# EAGLE design ESP_Breakout (EAGLE 9.2.0)
COMPANY: ADAFRUIT INDUSTRIES; DRAWN: KTOWN; REV: B
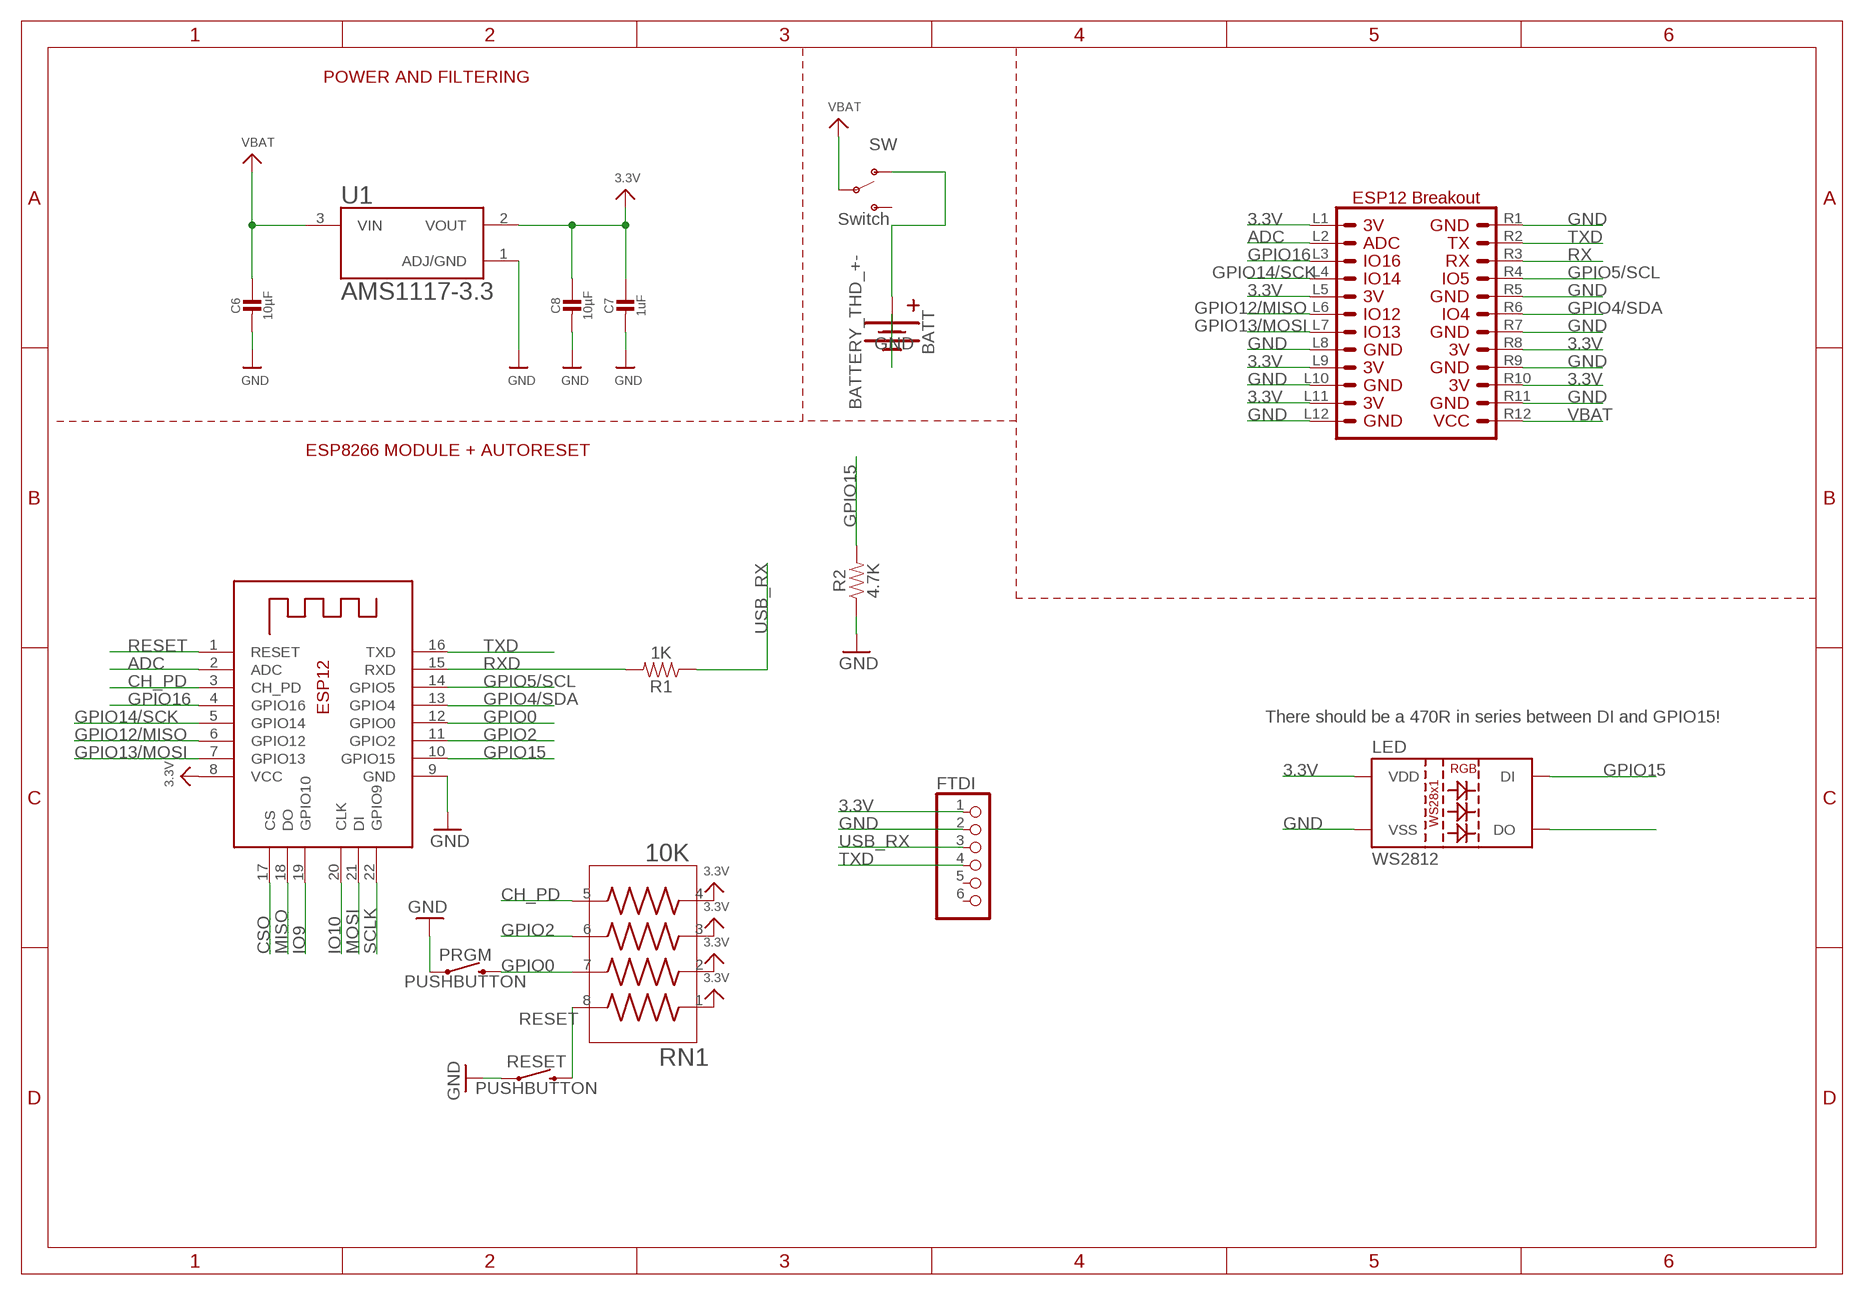
[diagram p0: schematic, sheet 1]

## Parts
BATT  BATTERY_THD_+-  [1X02_PLUS_MINUS]
C6  10µF  MICROBUILDER_CAP_CERAMIC_0805  [MICROBUILDER__0805]
C7  1uF  MICROBUILDER_CAP_CERAMIC_0603  [MICROBUILDER__0603]
C8  10µF  MICROBUILDER_CAP_CERAMIC_0805  [MICROBUILDER__0805]
FTDI  PINHD-1X6  [1X06]
LED  WS2812  [LED-TRICOLOR-5050-IC]
PRGM  PUSHBUTTON  [TACTILE_SWITCH_SMD_6.0X3.5MM]
R1  1K  RESISTOR1206  [1206]
R2  4.7K  RESISTOR1206  [1206]
RESET  PUSHBUTTON  [TACTILE_SWITCH_SMD_6.0X3.5MM]
RN1  10K  RESISTOR_ARRAY_1206  [RESCAF80P320X160X60-8N]
SW  Switch  SWITCH_SPDT_SLIDE  [SWITCH_SPDT_PTH_11.6X4.0MM]
U1  AMS1117-3.3  [SOT229P700X180-4N]
U$7  ESP12_BREAKOUT  [ESP12_BREAKOUT_CONN]
X2  ESP-12  ESP-12E  [ESP-12E]

## Nets
3.3V: C7.1 C8.1 FTDI.1 LED.VDD RN1.1 RN1.2 RN1.3 RN1.4 U1.2(VOUT) U$7.L1 U$7.L5 U$7.L9 U$7.L11 U$7.R8 U$7.R10 X2.8(VCC)
ADC: U$7.L2 X2.2(ADC)
CH_PD: RN1.5 X2.3(CH_PD)
CSO: X2.17(CS)
GND: BATT.- C6.2 C7.2 C8.2 FTDI.2 LED.VSS PRGM.1 R2.1 RESET.1 U1.1(ADJ/GND) U$7.L8 U$7.L10 U$7.L12 U$7.R1 U$7.R5 U$7.R7 U$7.R9 U$7.R11 X2.9(GND)
GPIO0: PRGM.2 RN1.7 X2.12(GPIO0)
GPIO2: RN1.6 X2.11(GPIO2)
GPIO4/SDA: U$7.R6 X2.13(GPIO4)
GPIO5/SCL: U$7.R4 X2.14(GPIO5)
GPIO12/MISO: U$7.L6 X2.6(GPIO12)
GPIO13/MOSI: U$7.L7 X2.7(GPIO13)
GPIO14/SCK: U$7.L4 X2.5(GPIO14)
GPIO15: LED.DIN(DI) R2.2 X2.10(GPIO15)
GPIO16: U$7.L3 X2.4(GPIO16)
IO9: X2.19(GPIO10)
IO10: X2.20(CLK)
MISO: X2.18(DO)
MOSI: X2.21(DI)
N$1: BATT.+ SW.1(O)
N$5: LED.DOUT(DO)
RESET: RESET.2 RN1.8 X2.1(RESET)
RX: U$7.R3
RXD: R1.2 X2.15(RXD)
SCLK: X2.22(GPIO9)
TXD: FTDI.4 U$7.R2 X2.16(TXD)
USB_RX: FTDI.3 R1.1
VBAT: C6.1 SW.2(P) U1.3(VIN) U$7.R12
Unconnected: FTDI.5 FTDI.6 SW.3(S)

## Notes on the sheet
- POWER AND FILTERING
- ESP8266 MODULE + AUTORESET
- There should be a 470R in series between DI and GPIO15!

## Library data of the parts
BATT = AutoPark:BATTERY_THD_+-
C6-C8 = AutoPark:MICROBUILDER_CAP_CERAMIC: Ceramic Capacitors For new designs, use the packages preceded by an '_' character since they are more reliable: The following footprints should be used on most boards: _0402 - Standard footprint for regular board layouts _0603 - Standard footprint for regular board layouts _0805 - Standard footprint for regular board layouts _1206 - Standard footprint for regular board layouts For extremely tight-pitch boards where space is at a premium, the following 'micro-pitch' footprints can be used (smaller pads, no silkscreen outline, etc.): _0402MP - Micro-pitch footprint for very dense/compact boards _0603MP - Micro-pitch footprint for very dense/compact boards _0805MP - Micro-pitch footprint for very dense/compact boards _1206MP - Micro-pitch footprint for very dense/compact boards
FTDI = pinhead:PINHD-1X6: PIN HEADER
LED = AutoPark:WS2812
PRGM RESET = AutoPark:PUSHBUTTON
R1 R2 = SparkFun-Resistors:RESISTOR: Generic Resistor Package
RN1 = AutoPark:RESISTOR_ARRAY_1206: Res Thick Film Array 75 Ohm 5% 0.25W(1/4W) ?200ppm/C ISOL Molded 8-Pin 1206(4 X 0603) Convex SMD T/R; AVAILABILITY: Unavailable; DESCRIPTION: Res Thick Film Array 75 Ohm 5% 0.25W_1/4W_ ?200ppm/C ISOL Molded 8-Pin 1206_4 X 0603_ Convex SMD T/R; MF: Bourns; MP: CAY16-750J4LF; PACKAGE: 1206 Bourns; PRICE: None
SW = AutoPark:SWITCH_SPDT_SLIDE: 拨动开关SK12D07VG2/3/4/5/6 侧面5脚拨动带支架 3脚2档柄高6MM Taobao <https://item.taobao.com/item.htm?spm=a1z09.2.0.0.53a62e8d0RVocC&id=563254128682&_u=s1po4ce26496> Dimensional Drawing <https://img.alicdn.com/imgextra/i1/2744920356/TB2568GkMDD8KJjy0FdXXcjvXXa_!!2744920356.jpg>
U1 = AutoPark:AMS1117-3.3: Sot223/Pkg 1-Amp 3.3-Volt Low Drop Out Voltage Regulatator; AVAILABILITY: Unavailable; DESCRIPTION: Sot223/Pkg 1-Amp 3.3-Volt Low Drop Out Voltage Regulatator; MF: Advanced Monolithic Systems; MP: AMS1117-3.3; PACKAGE: None; PRICE: None
U$7 = AutoPark:ESP12_BREAKOUT
X2 = microbuilder:ESP-12E

## Board
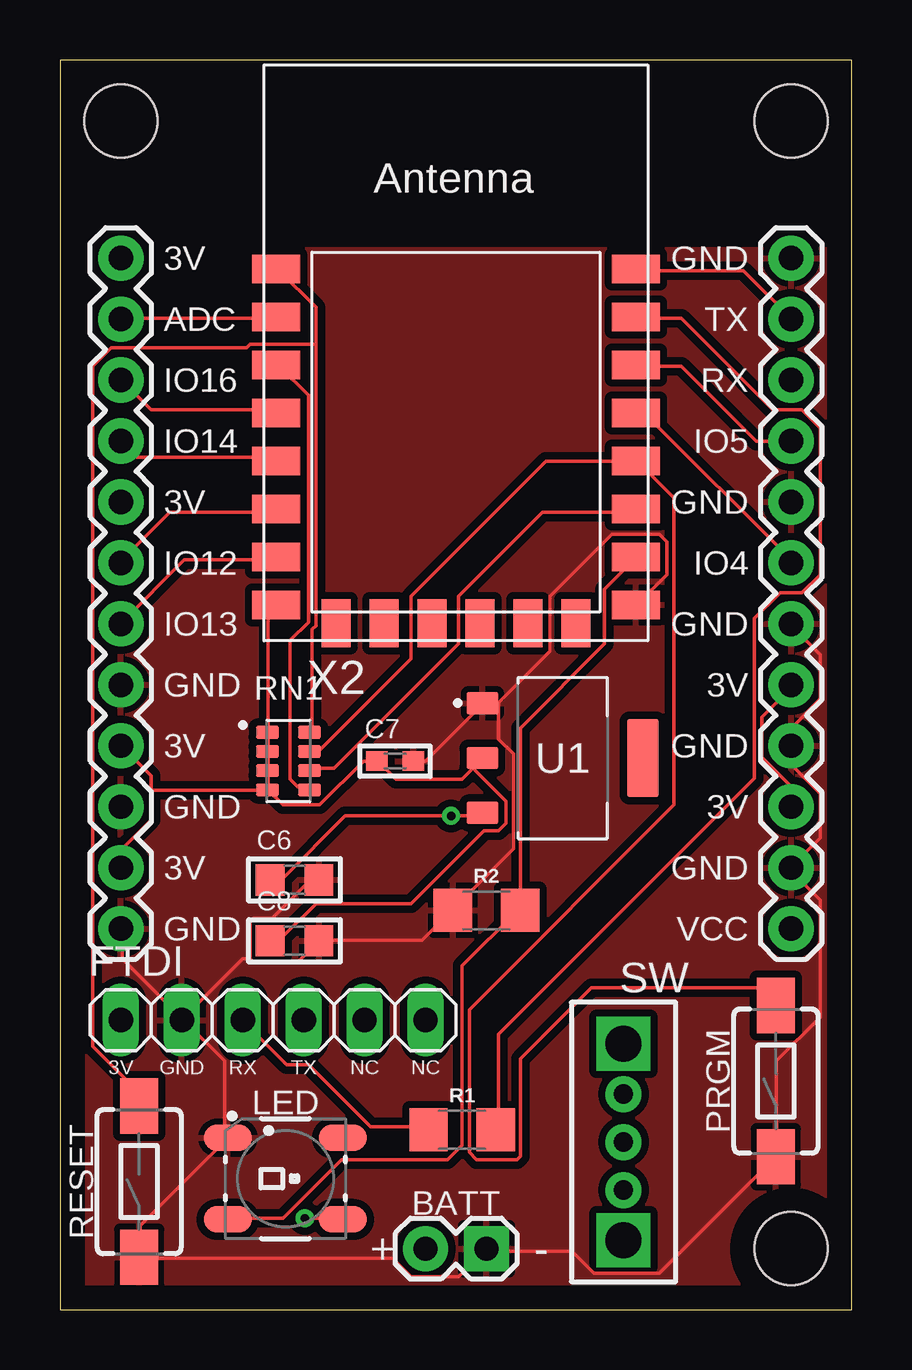
[diagram p1: board, top side]
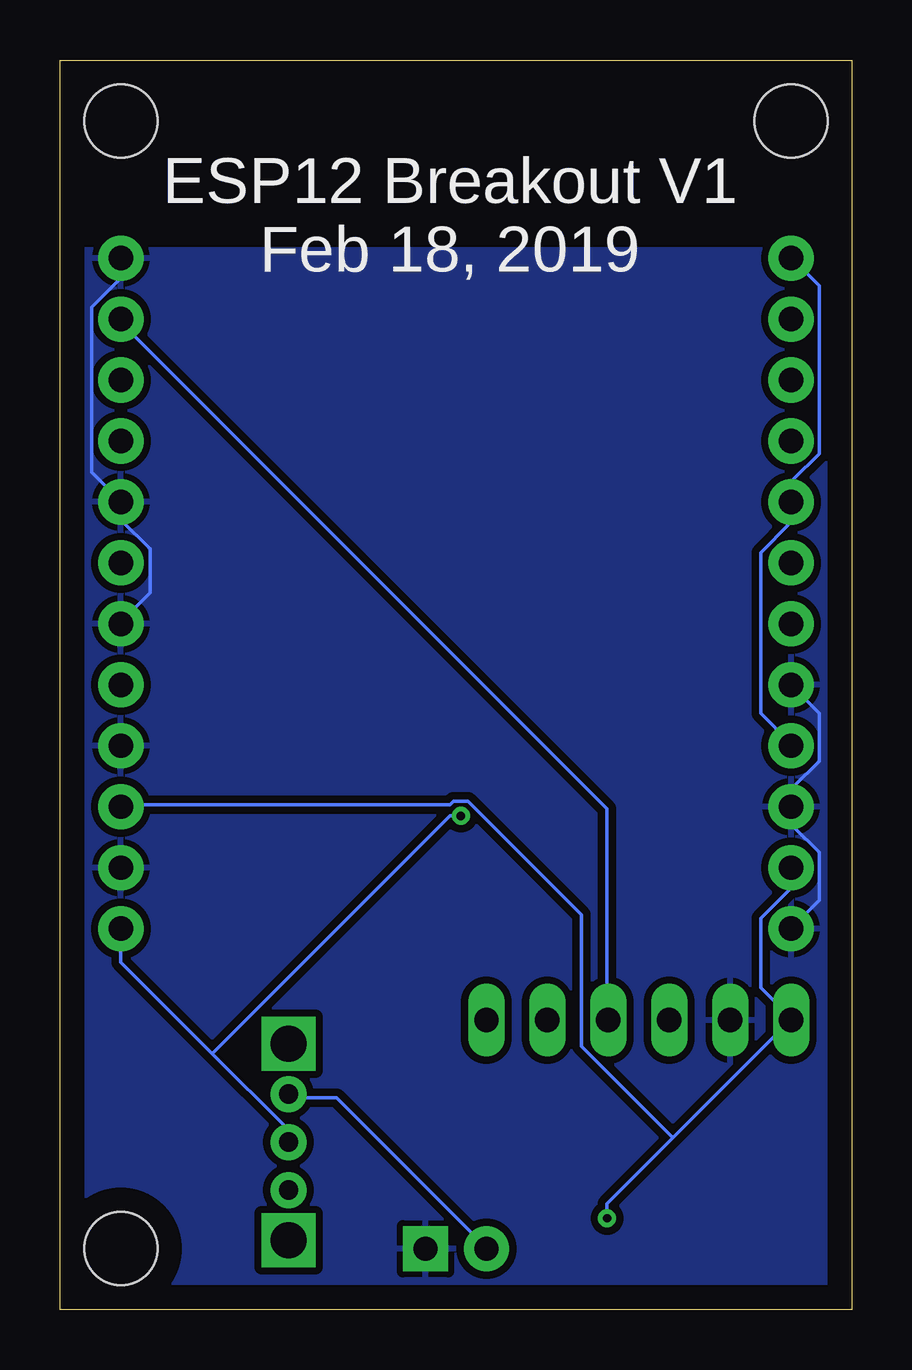
[diagram p2: board, bottom side, seen from below]

Size 33.02 x 52.07 mm. Coordinates in mm from the lower left corner, seen from the top.
Outline: 0,0 33.02,0 33.02,52.07 0,52.07 0,0
Copper layers (1*16): Top 0.035mm / dielectric 1.5mm / Bottom 0.035mm
Design rules "default *": minimum track width 6mil, minimum drill 0.35mm, track to track 6mil, track to pad 6mil, pad to pad 6mil, via to via 6mil, smd to smd 6mil, copper to edge 40mil, drill to drill 6mil, minimum pad ring 10mil, minimum via ring 8mil, stop-mask expansion 4mil, vias tented up to drill 15mil, thermal gap 10mil
Holes 3.05 mm at 30.48,2.54 30.48,49.53 2.54,49.53

### Footprints (pad centres in the part's own frame; a part is rotated, then mirrored left to right if it is on the bottom)
1X02_PLUS_MINUS = drill 1.016 pad 1.88: + 0,0 | drill 1.016 pad 1.88 square: - 2.54,0
MICROBUILDER__0805 = smd 1.2 x 1.3: 1 -1.016,0; 2 1.016,0
MICROBUILDER__0603 = smd 0.9 x 0.8: 1 -0.762,0; 2 0.762,0
1X06 = drill 1.016 long: 1 -6.35,0; 2 -3.81,0; 3 -1.27,0; 4 1.27,0; 5 3.81,0; 6 6.35,0
LED-TRICOLOR-5050-IC = smd 2 x 1.1: DIN -2.4,-1.7; DOUT 2.4,1.7; VDD 2.4,-1.7; VSS -2.4,1.7
TACTILE_SWITCH_SMD_6.0X3.5MM = smd 2.3 x 1.6: 1 -3.15,0; 2 3.15,0
1206 = smd 1.6 x 1.8: 1 -1.4,0; 2 1.4,0
RESCAF80P320X160X60-8N = smd 0.97 x 0.53: 1 -0.875,1.2; 2 -0.875,0.4; 3 -0.875,-0.4; 4 -0.875,-1.2; 5 0.875,-1.2; 6 0.875,-0.4; 7 0.875,0.4; 8 0.875,1.2
SWITCH_SPDT_PTH_11.6X4.0MM = drill 0.8 pad 1.5: 1 0,2; 2 0,0; 3 0,-2 | drill 1.5 pad 1.8 square: P$1 0,-4.1; P$2 0,4.1
SOT229P700X180-4N = smd 0.93 x 1.31: 1 -2.29,-3.345; 2 0,-3.345; 3 2.29,-3.345 | smd 3.24 x 1.31: 4 0,3.345
ESP12_BREAKOUT_CONN = drill 1.016 pad 1.88: L1 1.27,29.21; L2 1.27,26.67; L3 1.27,24.13; L4 1.27,21.59; L5 1.27,19.05; L6 1.27,16.51; L7 1.27,13.97; L8 1.27,11.43; L9 1.27,8.89; L10 1.27,6.35; L11 1.27,3.81; L12 1.27,1.27; R1 29.21,29.21; R2 29.21,26.67; R3 29.21,24.13; R4 29.21,21.59; R5 29.21,19.05; R6 29.21,16.51; R7 29.21,13.97; R8 29.21,11.43; R9 29.21,8.89; R10 29.21,6.35; R11 29.21,3.81; R12 29.21,1.27
ESP-12E = smd 2 x 1.2: 1 -7.5,5.77; 2 -7.5,3.77; 3 -7.5,1.77; 4 -7.5,-0.23; 5 -7.5,-2.23; 6 -7.5,-4.23; 7 -7.5,-6.23; 8 -7.5,-8.23; 9 7.5,-8.23; 10 7.5,-6.23; 11 7.5,-4.23; 12 7.5,-2.23; 13 7.5,-0.23; 14 7.5,1.77; 15 7.5,3.77; 16 7.5,5.77 | smd 1.2 x 2: 17 -5,-9; 18 -3,-9; 19 -1,-9; 20 1,-9; 21 3,-9; 22 5,-9

### Placement (x,y rotation side)
BATT  15.24,2.54 0 top
C6  9.78,17.91 0 top
C7  13.97,22.86 0 top
C8  9.78,15.37 0 top
FTDI  8.89,12.06 0 top
LED  9.4,5.46 0 top
PRGM  29.84,9.53 90 top
R1  16.76,7.49 0 top
R2  17.78,16.64 0 top
RESET  3.3,5.33 90 top
RN1  9.53,22.86 0 top
SW  23.5,6.99 0 top
U1  20.95,22.99 270 top
U$7  1.27,14.61 0 top
X2  16.51,37.59 0 top

### Tracks (layer width: path | path; a pad name or v marks a point on that pad's centre or on a via)
3.3V  (via drill 0.35)
  Top 0.152: 17.22,22.55 17.53,22.86 U1.2 17.22,22.55 | 17.22,22.55 16.76,22.1 14.02,22.1 13.26,22.86 C7.1 12.65,22.86 10.82,21.03 9.3,21.03 8.69,21.64 RN1.4 | 17.22,22.55 18.59,21.18 18.59,20.27 18.29,19.96 17.68,19.96 14.63,16.92 10.67,16.92 9.14,15.39 8.84,15.39 C8.1 | RN1.4 8.69,21.79 8.69,22.4 RN1.3 8.69,22.55 8.69,23.16 RN1.2 8.69,23.32 8.69,23.93 RN1.1 8.69,24.08 8.69,28.96 8.99,29.26 X2.8 | 3.81,21.64 3.81,22.25 2.59,23.47 U$7.L9 | 3.81,21.64 3.81,20.42 2.59,19.2 2.59,18.44 U$7.L11 | 3.81,21.64 8.53,21.64 RN1.4 | U$7.R10 30.48,21.79 29.26,23.01 29.26,24.69 30.48,25.91 U$7.R8 | v10.21,3.81 11.73,3.81 LED.VDD
  Bottom 0.152: U$7.L1 2.44,43.74 1.37,42.67 1.37,35.66 2.44,34.59 2.44,33.68 U$7.L5 2.59,33.53 2.59,32.77 3.81,31.55 3.81,24.84 2.59,23.62 U$7.L9 | v10.21,3.81 10.21,4.42 7.47,7.16 | 7.47,7.16 2.59,12.04 FTDI.1 2.59,12.19 3.81,13.41 3.81,16.31 2.59,17.53 2.59,18.29 U$7.L11 | 7.47,7.16 11.28,10.97 11.28,16.46 16,21.18 16.61,21.18 16.76,21.03 30.48,21.03 U$7.R10
ADC
  Top 0.152: X2.2 8.99,41.3 2.59,41.3 U$7.L2
CH_PD
  Top 0.152: RN1.5 10.36,21.79 9.91,21.79 9.6,22.1 9.6,27.89 10.36,28.65 10.36,38.1 9.14,39.32 X2.3
GND
  Top 0.152: C7.2 15.24,22.86 17.53,25.15 U1.1 17.68,25.3 18.29,25.3 | 18.29,25.3 20.42,27.43 20.42,29.72 23.01,32.31 24.99,32.31 25.3,32 25.3,30.63 24.08,29.41 X2.9 | 7.92,14.63 7.92,16.15 8.08,16.31 8.84,16.31 10.36,17.83 10.67,17.83 C6.2 | 7.92,14.63 8.08,14.48 9.91,14.48 C8.2 10.82,15.39 15.09,15.39 16.31,16.61 R2.1 16.46,16.76 18.9,19.2 18.9,23.16 18.29,23.77 18.29,25.3 | FTDI.2 5.18,12.04 6.86,10.36 6.86,7.16 LED.VSS 6.86,7.01 3.35,3.5 3.35,2.29 RESET.1 3.35,2.13 13.87,2.13 14.63,1.37 16.61,1.37 BATT.- 17.83,2.44 21.34,2.44 22.25,1.52 24.99,1.52 29.72,6.25 PRGM.1 29.87,6.4 29.87,10.36 31.7,12.19 31.7,17.07 30.48,18.29 U$7.R11 30.48,18.44 31.7,19.66 31.7,21.49 30.48,22.71 U$7.R9 30.48,24.23 31.7,25.45 31.7,27.28 30.48,28.5 U$7.R7 | U$7.L12 2.59,15.85 2.59,14.63 5.03,12.19 FTDI.2 | 7.92,14.63 7.62,14.63 5.18,12.19 FTDI.2
  Bottom 0.152: U$7.L8 2.44,25.91 1.37,24.84 1.37,22.86 2.44,21.79 2.44,21.03 U$7.L10 2.44,20.88 2.44,20.12 1.37,19.05 1.37,17.07 2.44,16 U$7.L12 | U$7.R7 30.48,28.65 29.26,29.87 29.26,31.7 30.48,32.92 U$7.R5 30.48,33.68 31.7,34.9 31.7,41.76 30.48,42.98 U$7.R1
  pour Top (isolate 0.305): 33.02,44.2 0,44.2 0,0 33.02,0
  pour Bottom (isolate 0.305): 33.02,44.2 33.02,0 0,0 0,44.2
GPIO0
  Top 0.152: RN1.7 10.52,23.32 10.82,23.32 14.63,27.13 14.63,29.72 20.27,35.36 23.93,35.36 X2.12 24.08,35.36 25.6,33.83 25.6,21.03 17.07,12.5 17.07,6.55 17.37,6.25 19.05,6.25 19.2,6.4 19.2,10.46 22.15,13.41 29.11,13.41 PRGM.2
GPIO2
  Top 0.152: RN1.6 10.52,22.55 11.43,22.55 16.61,27.74 16.61,29.72 20.12,33.22 23.93,33.22 X2.11
GPIO4/SDA
  Top 0.152: X2.13 24.08,37.34 24.38,37.34 30.48,31.24 U$7.R6
GPIO5/SCL
  Top 0.152: U$7.R4 29.03,36.2 25.91,39.32 24.08,39.32 X2.14
GPIO12/MISO
  Top 0.152: X2.6 8.99,33.22 4.57,33.22 2.59,31.24 U$7.L6
GPIO13/MOSI
  Top 0.152: X2.7 8.99,31.24 5.18,31.24 2.59,28.65 U$7.L7
GPIO14/SCK
  Top 0.152: X2.5 8.99,35.51 3.2,35.51 2.59,36.12 U$7.L4
GPIO15
  Top 0.152: X2.10 23.93,31.24 22.71,30.02 22.71,27.74 19.2,24.23 19.2,16.76 R2.2 19.05,16.61 16.76,14.33 16.76,6.86 16.15,6.25 11.73,6.25 9.3,3.81 7.01,3.81 LED.DIN
GPIO16
  Top 0.152: X2.4 8.99,37.49 3.81,37.49 2.59,38.71 U$7.L3
N$1
  Bottom 0.152: SW.1 23.47,8.84 21.49,8.84 15.24,2.59 BATT.+
RESET
  Top 0.152: 10.67,40.23 10.67,41.76 9.14,43.28 X2.1 | 10.67,40.23 10.67,28.5 10.52,28.35 10.52,24.08 RN1.8 | 10.67,40.23 7.92,40.23 7.77,40.08 2.13,40.08 1.37,39.32 1.37,10.97 3.2,9.14 3.2,8.53 RESET.2
RXD
  Top 0.152: R1.2 18.29,7.62 18.29,11.48 28.96,22.15 28.96,28.8 30.02,29.87 30.94,29.87 31.7,30.63 31.7,36.73 30.94,37.49 29.72,37.49 25.91,41.3 24.08,41.3 X2.15
TXD
  Top 0.152: X2.16 24.08,43.28 28.5,43.28 30.48,41.3 U$7.R2
  Bottom 0.152: FTDI.4 10.21,12.19 10.21,20.88 30.48,41.15 U$7.R2
USB_RX
  Top 0.152: R1.1 15.24,7.62 12.95,7.62 10.36,10.21 9.45,10.21 7.62,12.04 FTDI.3
VBAT  (via drill 0.35)
  Top 0.152: C6.1 8.84,17.98 9.3,17.98 11.89,20.57 v16.31,20.57 17.53,20.57 U1.3
  Bottom 0.152: 26.67,10.67 30.48,14.48 U$7.R12 | 26.67,10.67 23.62,7.62 23.62,7.01 SW.2 | v16.31,20.57 16.76,20.57 26.67,10.67

### Text on the board
tPlace: 3V | GND | RX | TX | NC | NC
bPlace: ESP12 Breakout V1 / Feb 18, 2019